# Altium project ESP_Homeauto.PrjPcb
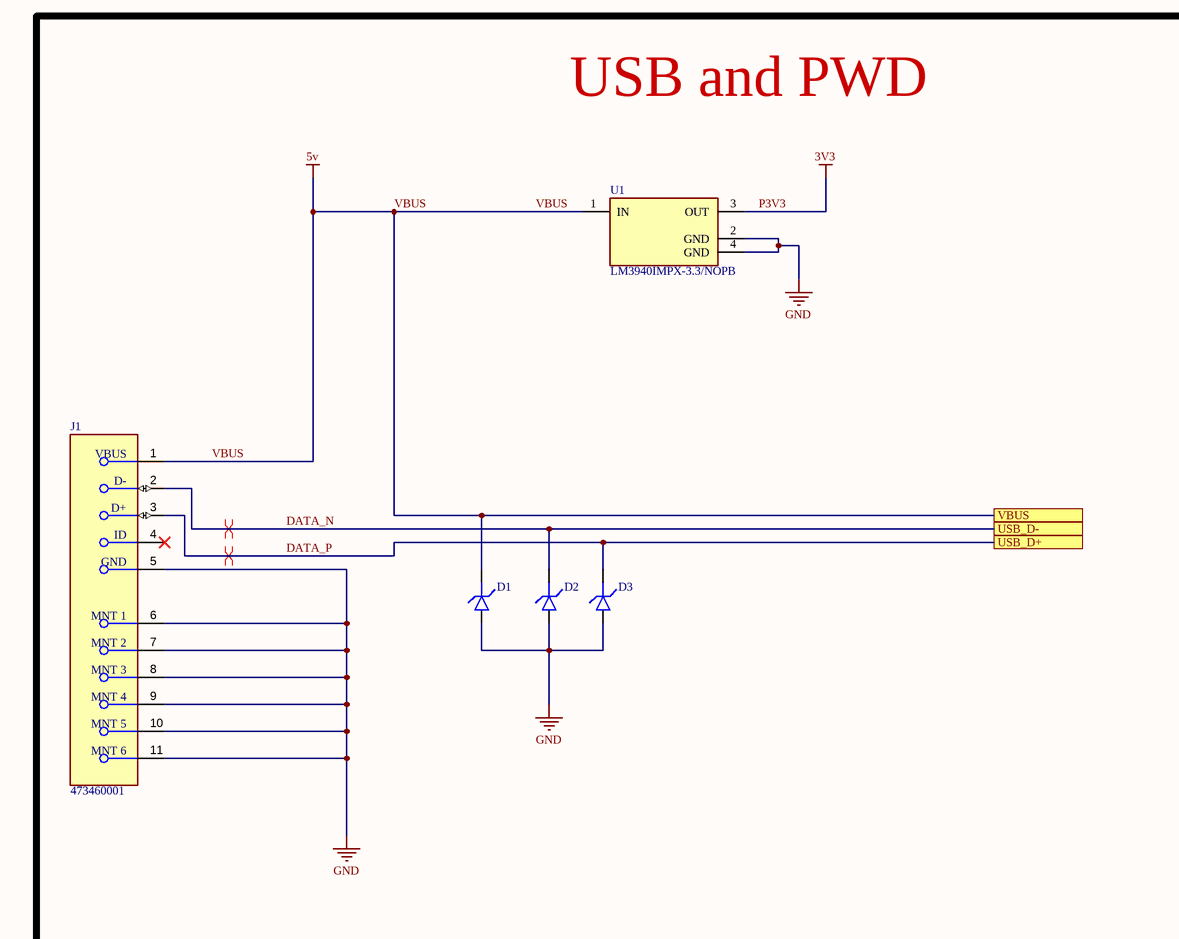
[diagram p0: home_auto.SchDoc, top left]
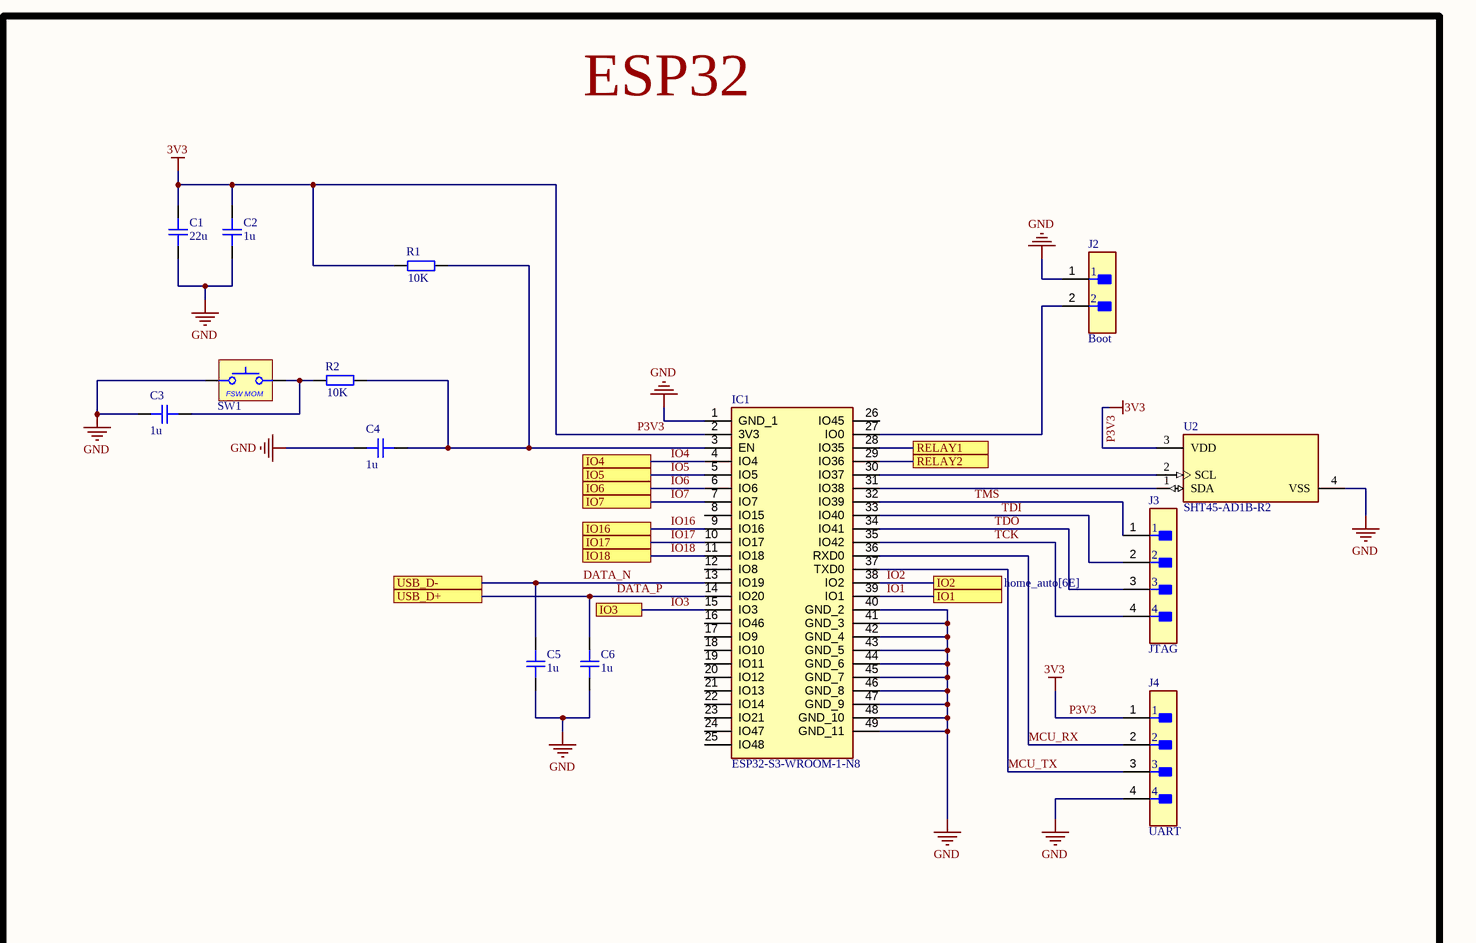
[diagram p1: home_auto.SchDoc, top right]
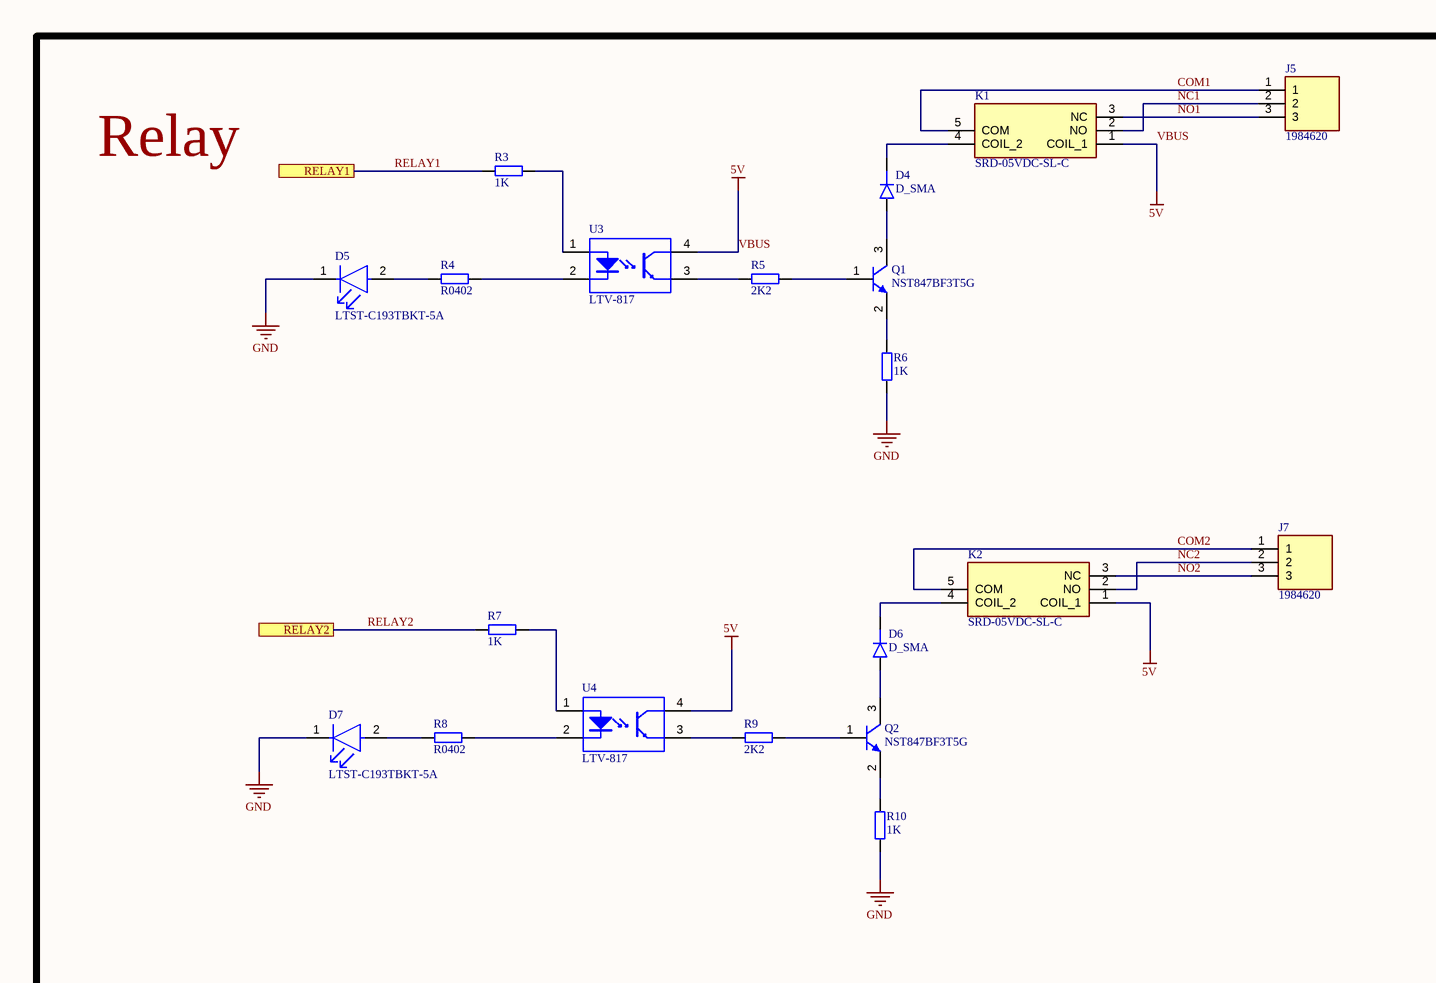
[diagram p2: home_auto.SchDoc, bottom left]
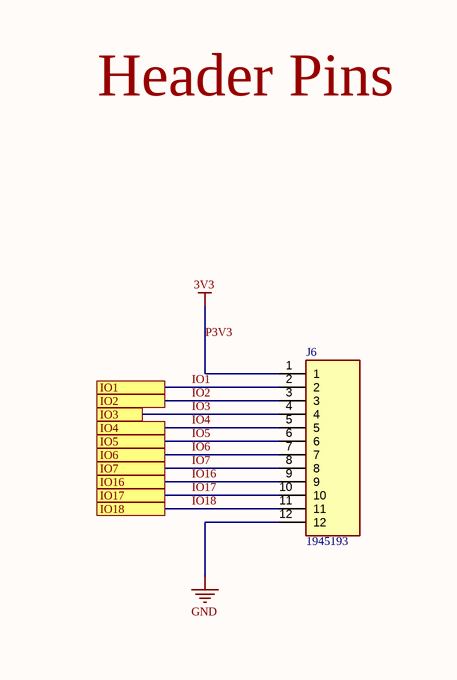
[diagram p3: home_auto.SchDoc, bottom right]
1 sheet, 40 parts. Net scope: flat (ports and power ports of the same name join across sheets).
Board file: home_auto.PcbDoc

## Sheet home_auto.SchDoc
size 594 x 420 mm; SheetNumber: 1; SheetTotal: 1

### Parts
C1  22u  [CAP_0402]
C2  1u  [CAP_0402]
C3  1u  [CAP_0402]
C4  1u  [CAP_0402]
C5  1u  [CAP_0402]
C6  1u  [CAP_0402]
D1  (no value)  [D_0402]
D2  (no value)  [D_0402]
D3  (no value)  [D_0402]
D4  D_SMA  [DO-214AC-2 (SMA)]
D5  LTST-C193TBKT-5A  [FP-LTST-C193TBKT-5A-MFG]
D6  D_SMA  [DO-214AC-2 (SMA)]
D7  LTST-C193TBKT-5A  [FP-LTST-C193TBKT-5A-MFG]
IC1  ESP32-S3-WROOM-1-N8  [ESP32S3WROOM1N8R2]
J1  473460001  [FP-473460001-MFG]
J2  Boot  [FP-M20-9990246-MFG]
J3  JTAG  [FP-TMM-104-06-L-S-SM-MFG]
J4  UART  [FP-TMM-104-06-L-S-SM-MFG]
J5  1984620  [1984620]
J6  1945193  [1945193]
J7  1984620  [1984620]
K1  SRD-05VDC-SL-C  [SRD05VDCSLC]
K2  SRD-05VDC-SL-C  [SRD05VDCSLC]
Q1  NST847BF3T5G  [ONSC-SOT-1123-3-524AA_V]
Q2  NST847BF3T5G  [ONSC-SOT-1123-3-524AA_V]
R1  10K  [RES_0402]
R2  10K  [RES_0402]
R3  1K  [RES_0402]
R4  R0402  [RES_0402]
R5  2K2  [RES_0402]
R6  1K  [RES_0402]
R7  1K  [RES_0402]
R8  R0402  [RES_0402]
R9  2K2  [RES_0402]
R10  1K  [RES_0402]
SW1  FOOTSWITCH_MOM  [FOOTSWITCH_MOM]  (value not drawn)
U1  LM3940IMPX-3.3/NOPB  [FP-DCY0004A-MFG]
U2  SHT45-AD1B-R2  [FP-SHT45-AD1B-R2-MFG]
U3  LTV-817  [LTST-LTV-817-4]
U4  LTV-817  [LTST-LTV-817-4]

### Blocks framed on the sheet
USB and PWD: D1-D3 J1 U1
ESP32: C1-C6 IC1 J2-J4 R1 R2 SW1 U2
Relay: D4-D7 J5 J7 K1 K2 Q1 Q2 R3-R10 U3 U4
Header Pins: J6

### Ports
IO1 (see home_auto[6E]), IO1 (see home_auto[7B]), IO2 (see home_auto[6E]), IO2 (see home_auto[7B]), IO3 (see home_auto[6B]), IO3 (see home_auto[6E]), IO4 (see home_auto[6B]), IO4 (see home_auto[6E]), IO5 (see home_auto[6B]), IO5 (see home_auto[6E]), IO6 (see home_auto[6B]), IO6 (see home_auto[6E]), IO7 (see home_auto[6B]), IO7 (see home_auto[6E]), IO16 (see home_auto[6B]), IO16 (see home_auto[6E]), IO17 (see home_auto[6B]), IO17 (see home_auto[6E]), IO18 (see home_auto[6B]), IO18 (see home_auto[6E]), RELAY1 (see home_auto[1D]), RELAY1 (see home_auto[7B]), RELAY2 (see home_auto[1E]), RELAY2 (see home_auto[7B]), USB_D+ (see home_auto[3B]), USB_D+ (see home_auto[5B]), USB_D- (see home_auto[3B]), USB_D- (see home_auto[5B]), VBUS

### Nets
GND: C1.1 C2.1 C3.2 C4.2 C5.1 C6.1 D1.A D2.A D3.A D5.1(C) D7.1(C) IC1.1(GND_1) IC1.40(GND_2) IC1.41(GND_3) IC1.42(GND_4) IC1.43(GND_5) IC1.44(GND_6) IC1.45(GND_7) IC1.46(GND_8) IC1.47(GND_9) IC1.48(GND_10) IC1.49(GND_11) J1.5(GND) J1.6(MNT_1) J1.7(MNT_2) J1.8(MNT_3) J1.9(MNT_4) J1.10(MNT_5) J1.11(MNT_6) J2.1 J4.4 J6.12 R6.1 R10.1 SW1.1 U1.2(GND) U1.4(GND) U2.4(VSS)
P3V3: C1.2 C2.2 IC1.2(3V3) J4.1 J6.1 R1.1 U1.3(OUT) U2.3(VDD)  [also labelled 3V3]
VBUS: D1.K J1.1(VBUS) K1.1(COIL_1) K2.1(COIL_1) U1.1(IN) U3.4(COLLECTOR) U4.4(COLLECTOR) ; port VBUS  [also labelled 5v]
COM1: J5.1 K1.5(COM)
COM2: J7.1 K2.5(COM)
DATA_N: C5.2 D2.K IC1.13(IO19) J1.2(D-) ; port USB_D-
DATA_P: C6.2 D3.K IC1.14(IO20) J1.3(D+) ; port USB_D+
IO1: IC1.39(IO1) J6.2 ; port IO1
IO2: IC1.38(IO2) J6.3 ; port IO2
IO3: IC1.15(IO3) J6.4 ; port IO3
IO4: IC1.4(IO4) J6.5 ; port IO4
IO5: IC1.5(IO5) J6.6 ; port IO5
IO6: IC1.6(IO6) J6.7 ; port IO6
IO7: IC1.7(IO7) J6.8 ; port IO7
IO16: IC1.9(IO16) J6.9 ; port IO16
IO17: IC1.10(IO17) J6.10 ; port IO17
IO18: IC1.11(IO18) J6.11 ; port IO18
MCU_RX: IC1.36(RXD0) J4.2
MCU_TX: IC1.37(TXD0) J4.3
NC1: J5.2 K1.2(NO)
NC2: J7.2 K2.2(NO)
NO1: J5.3 K1.3(NC)
NO2: J7.3 K2.3(NC)
RELAY1: IC1.28(IO35) R3.1 ; port RELAY1
RELAY2: IC1.29(IO36) R7.1 ; port RELAY2
TCK: IC1.35(IO42) J3.4
TDI: IC1.33(IO40) J3.2
TDO: IC1.34(IO41) J3.3
TMS: IC1.32(IO39) J3.1
NetC3_1: C3.1 R2.1 SW1.2
NetC4_1: C4.1 IC1.3(EN) R1.2 R2.2
NetD4_A: D4.A Q1.3(C)
NetD4_K: D4.K K1.4(COIL_2)
NetD5_2: D5.2(A) R4.1
NetD6_A: D6.A Q2.3(C)
NetD6_K: D6.K K2.4(COIL_2)
NetD7_2: D7.2(A) R8.1
NetIC1_27: IC1.27(IO0) J2.2
NetIC1_30: IC1.30(IO37) U2.2(SCL)
NetIC1_31: IC1.31(IO38) U2.1(SDA)
NetQ1_1: Q1.1(B) R5.2
NetQ1_2: Q1.2(E) R6.2
NetQ2_1: Q2.1(B) R9.2
NetQ2_2: Q2.2(E) R10.2
NetR3_2: R3.2 U3.1(ANODE)
NetR4_2: R4.2 U3.2(CATHODE)
NetR5_1: R5.1 U3.3(EMITTER)
NetR7_2: R7.2 U4.1(ANODE)
NetR8_2: R8.2 U4.2(CATHODE)
NetR9_1: R9.1 U4.3(EMITTER)

Not connected (* = marked no-connect by the designer): IC1 8(IO15) 12(IO8) 16(IO46) 17(IO9) 18(IO10) 19(IO11) 20(IO12) 21(IO13) 22(IO14) 23(IO21) 24(IO47) 25(IO48) 26(IO45); J1 4(ID)*

### Layout directives
differential pair: DATA_N, DATA_P

### Notes on the sheet
- DWG NO:
- REV:
- THIS DOCUMENT AND THE DATA DISCLOSED HEREIN OR
- HEREWITH IS THE PROPERTY OF ALTIUM LIMITED AND MAY
- BE FREELY DISTRIBUTED IN WHOLE. NO RIGHTS ARE
- RESERVED OR EXPRESS OR IMPLIED WARANTEE GIVEN.
- REVISION
- DESCRIPTION
- DATE
- APPROVED
- ENG:
- APPROVALS
- PROJECT
- DSN:
- CHK:
- REFERENCE DOCUMENTS
- PROJECT REVISION:
- TITLE
- DOCUMENT REVISION:
- DESIGN ITEM:
- BOM:
- FAB DWG:
- PCB DWG:
- ASSY DWG:
- SCALE:
- A2
- SIZE
- CAGE CODE
- FILE NAME
- DWG NO.
- SHEET
- OF
- REV
- (in symbol FOOTSWITCH_MOM) FSW MOM

### Library data of the parts
C1-C6 = CAP_0402: Capacitor SMD 0402; Manufacturer: *; Manufacturer Part Number: *; Distributor Link: *; LCSC: *; Rating: *; Dielectric: *
D1-D3 = D_TVS_0402: Diode TVS / ESD 0402
D4 D6 = D_SMA: Diode SMD SMA (DO-214AA)
D5 D7 = CMP-2000-06624-2: LED BLUE CLEAR CHIP SMD; Number of Elements: 1; Forward Voltage: 2.8V; Forward Current: 20mA; Test Current: 5mA; Lens Color: Colorless; Dominant Wavelength: 475nm; Reverse Voltage: 5V; Viewing Angle: 130°; Lens Style: Diffused; Luminous Intensity: 15mcd; Power Dissipation: 76mW; Max Operating Temperature: 80°C; Length: 1.6mm; Number of LEDs: 1; Case/Package: 0603; Case Code (Metric): 1608; Number of Pins: 2; Radiation Hardening: No; Min Operating Temperature: -20°C; Width: 0.8mm; Packaging: Tape and Reel; Package Quantity: 1; Lead Free: Lead Free; Lens Transparency: Clear; Illumination Color: Blue; Color: Blue; RoHS Compliant: Yes; Mount: Surface Mount; Depth: 0.8mm; Case Code (Imperial): 0603; Height: 0.35mm
IC1 = ESP32-S3-WROOM-1-N8: Integrated Circuit; Manufacturer_Name: Espressif Systems; Datasheet Link: https://www.espressif.com/sites/default/files/documentation/esp32-s3-wroom-1_wroom-1u_datasheet_en.pdf; Height: 3.25mm; Manufacturer_Part_Number: ESP32-S3-WROOM-1-N8; Mouser Part Number: 356-ESP32-S3WROOM1N8; Mouser Price/Stock: https://www.mouser.co.uk/ProductDetail/Espressif-Systems/ESP32-S3-WROOM-1-N8?qs=Wj%2FVkw3K%252BMC1mq0KGPvoSQ%3D%3D
J1 = CMP-2000-05246-2: CONN RCPT USB2.0 MICRO B SMD R/A; Manufacturer: Molex; Conn Orientation: Right Angle; Is Female: yes; Shielding: true; Pitch: 0.65mm; Number Of Contacts: 5; Description: USB - micro B USB 2.0 Receptacle Connector 5 Position Surface Mount, Right Angle; Voltage Rating: 30V; Current Rating: 1.8A; Device Class L2: USB Connectors; Digikey Description: CONN RCPT USB2.0 MICRO B SMD R/A; Height: 2.945mm; RoHS: TRUE; ComponentLink2Description: Datasheet; Octopart: https://octopart.com/47346-0001-molex-7164928; Automotive: No; Package: 0; Category: Conn; Device Class L1: Connectors; Usb Standard: USB 2.0; Temperature: -30°C to +85°C; Temperature Range Low: -30°C; Footprint Url: https://www.molex.com/pdm_docs/sd/473460001_sd.pdf; ComponentLink2URL: https://www.molex.com/webdocs/datasheets/pdf/en-us/0473460001_IO_CONNECTORS.pdf; Lead Free: Yes; Manufacturer Part Number: 473460001; Contact Material: Gold,Nickel; Temperature Range High: +85°C; Device Class L3: unset
J2 = CMP-15831-000009-1: CONN HEADER VERT 2POS 2.54MM; Manufacturer: Harwin; Manufacturer Part Number: M20-9990246; Conn Gender: Male; Conn Orientation: Vertical; Number Of Contacts: 2; Current Rating: 3A; ComponentLink2URL: https://cdn.harwin.com/pdfs/M20-999.pdf; ComponentLink2Description: Datasheet; Package: M20-9990246; Temperature: -40°C to +105°C; Octopart: https://octopart.com/m20-9990246-harwin-2590635; Mouser Description: 2.54mm (0.1") Pitch SIL Vertical PC Tail Pin Header, 6.1mm mating pin height, tin, 2 contacts; Temperature Range High: +105°C; Device Class L1: Connectors; RoHS: TRUE; Automotive: No; Height: 8.99mm; Number Of Rows: 1; Contact Material: Tin,Nickel; Category: Conn; Pitch: 2.54mm; Lead Free: Yes; Digikey Description: CONN HEADER VERT 2POS 2.54MM; Temperature Range Low: -40°C; Device Class L3: unset; Device Class L2: Headers and Wire Housings
J3 J4 = CMP-02766-001580-1: 2MM TERMINAL STRIP; Connector Type: Header; Max Current Rating: 3.9A; Number of Positions: 4; Gender: Male; Max Voltage Rating (AC): 500V; Contact Type: Male Pin; Flammability Rating: UL94 V-0; Length: 8mm; Housing Material: Polymer; Contact Finish - Mating: GOLD; Fastening Type: Pull; Max Operating Temperature: 125°C; Contact Shape: Square; Number of Contacts: 4; Series: TMM; Pitch: 2mm; Orientation: Straight; RoHS Compliant: Yes; Lead Free: Lead Free; Contact Material: Bronze; Termination: Solder; Insulation Color: Black; Min Operating Temperature: -55°C; Insulation Material: Polymer; Housing Color: Black; Number of Rows: 1; Packaging: Rail/Tube; Depth: 1.97mm; Contact Plating: Gold; Radiation Hardening: No
J5 J7 = 1984620: Connector; Manufacturer_Name: Phoenix Contact; Datasheet Link: https://datasheet.datasheetarchive.com/originals/distributors/SFDatasheet-2/sf-00059019.pdf; Height: 9.3mm; Manufacturer_Part_Number: 1984620; Mouser Part Number: 651-1984620; Mouser Price/Stock: https://www.mouser.co.uk/ProductDetail/Phoenix-Contact/1984620?qs=qPbxTIUfeZanCGLWbKOtjg%3D%3D; Arrow Part Number: 1984620; Arrow Price/Stock: https://www.arrow.com/en/products/1984620/phoenix-contact?utm_currency=USD&region=nac
J6 = 1945193: Connector; Manufacturer_Name: Phoenix Contact; Datasheet Link: http://www.phoenixcontact.com/de/produkte/1945193/pdf; Height: 9.2mm; Manufacturer_Part_Number: 1945193; Mouser Part Number: 651-1945193; Mouser Price/Stock: https://www.mouser.co.uk/ProductDetail/Phoenix-Contact/1945193?qs=BYlwlsDsB%2Fqar1yaPw8fZg%3D%3D; Arrow Part Number: 1945193; Arrow Price/Stock: https://www.arrow.com/en/products/1945193/phoenix-contact?region=nac
K1 K2 = SRD-05VDC-SL-C: Relay or Contactor; Manufacturer_Name: EAGLE; Datasheet Link: http://www.songlerelay.com/Public/Uploads/20161104/581c81ac16e36.pdf; Height: 15.8mm; Manufacturer_Part_Number: SRD-05VDC-SL-C
Q1 Q2 = CMP-1048-00443-1: NPN General Purpose Transistor, 3-Pin SOT-1123, Pb-Free, Tape and Reel; Manufacturer: On Semiconductor; fT Min (MHz): 100; IC Continuous (A): 0.1; RoHS: TRUE; PartNumber: NST847BF3T5G; Packing: Tape and Reel; ComponentLink3Description: Package Specification; ComponentLink2URL: http://www.onsemi.com/pub_link/Collateral/NST847BF3-D.PDF; PackageReference: SOT-1123-3-524AA; PackageDescription: 3-Pin Small Outline Transistor, Body 0.8 x 0.6 mm, Pitch 0.375 mm; PackageVersion: Rev. C, 11/2011; ComponentLink1Description: Manufacturer URL; Mounting Technology: Surface Mount; ComponentLink2Description: Datasheet; ComponentLink1URL: http://www.onsemi.com/; DatasheetVersion: Rev. 1; Polarity: NPN; ComponentLink3URL: http://www.onsemi.cn/pub_link/Collateral/524AA.PDF
R1-R10 = RES_0402: Resistor SMD 0402; Manufacturer: *; Manufacturer Part Number: *; Distributor Link: *; LCSC: *
SW1 = FOOTSWITCH_MOM: Header 2.54mm THT for Momentary SPST Footswitch
U1 = CMP-04917-000180-1: IC REG LINEAR 3.3V 1A SOT223-4; Polarity: Positive; Dropout Voltage: 500mV; Number of Regulators: 1; Min Input Voltage: 4.5V; Quiescent Current: 15mA; Output Type: Fixed; Max Input Voltage: 7.5V; Packaging: Tape and Reel; Mount: Surface Mount; Number of Pins: 4; Package Quantity: 2000; Output Current: 1A; Min Operating Temperature: -40°C; Contact Plating: Tin; Max Output Current: 1A; Radiation Hardening: No; Output Voltage: 3.3V; Lead Free: Lead Free; Case/Package: SOT-223; Number of Outputs: 1; Max Operating Temperature: 125°C; RoHS Compliant: Yes
U2 = CMP-144040-000011-1: SENSOR HUMID/TEMP HIGH ACCURACY
U3 U4 = CMP-2000-06632-1: Photocoupuler, 50 mA Forward Current, 1.2 V Forward Voltage, -50 to 110 degC, 4-Pin DIP, RoHS, Tube; Manufacturer: Lite-On; Maximum Fall Time: 18us; Maximum Collector Emitter Saturation Voltage: 200mV; Maximum Forward Voltage: 1.4V; Typical Rise Time: 4us; Maximum Collector Current: 50mA; Maximum Collector Emitter Voltage: 35V; Product Length: 4.6mm; Maximum Reverse Voltage: 6V; Minimum Isolation Voltage: 5000Vrms; Number of Channels per Chip: 1; Typical Fall Time: 3us; Product Width: 6.5mm; Minimum Current Transfer Ratio: 50%; Output Type: DC; Output Device: Transistor; Maximum Current Transfer Ratio: 600%; Pin_Count: 4; Product Height: 3.5mm; Maximum Power Dissipation: 200mW; Typical Forward Voltage: 1.2V; Package Reference: LTV-817; Datasheet URL: http://optoelectronics.liteon.com/upload/download/DS70-2012-0050/S_110_LTV-8X7%20series%200915.pdf; Family: LTV817; Package Description: 4-Pin Double In-line Package, Body 6.5 x 4.6 mm, Pitch 2.54 mm; Maximum Rise Time: 18us; Product Type: TransistorandPhotovoltaicOutputPhotoCouplers; Supplier_Package: PDIP; Mounting: ThroughHole; Minimum Operating Temperature: -30C; Manufacturer URL: http://www.us.liteon.com/; Datasheet Version: Rev. E, 10/2015; Mounting Technology: ThroughHole; Maximum Operating Temperature: 100C; Input Type: DC; Maximum Input Current: 50mA